# Altium schematic sheet Sheet1.SchDoc
size A3; SheetNumber: 1; SheetTotal: 1
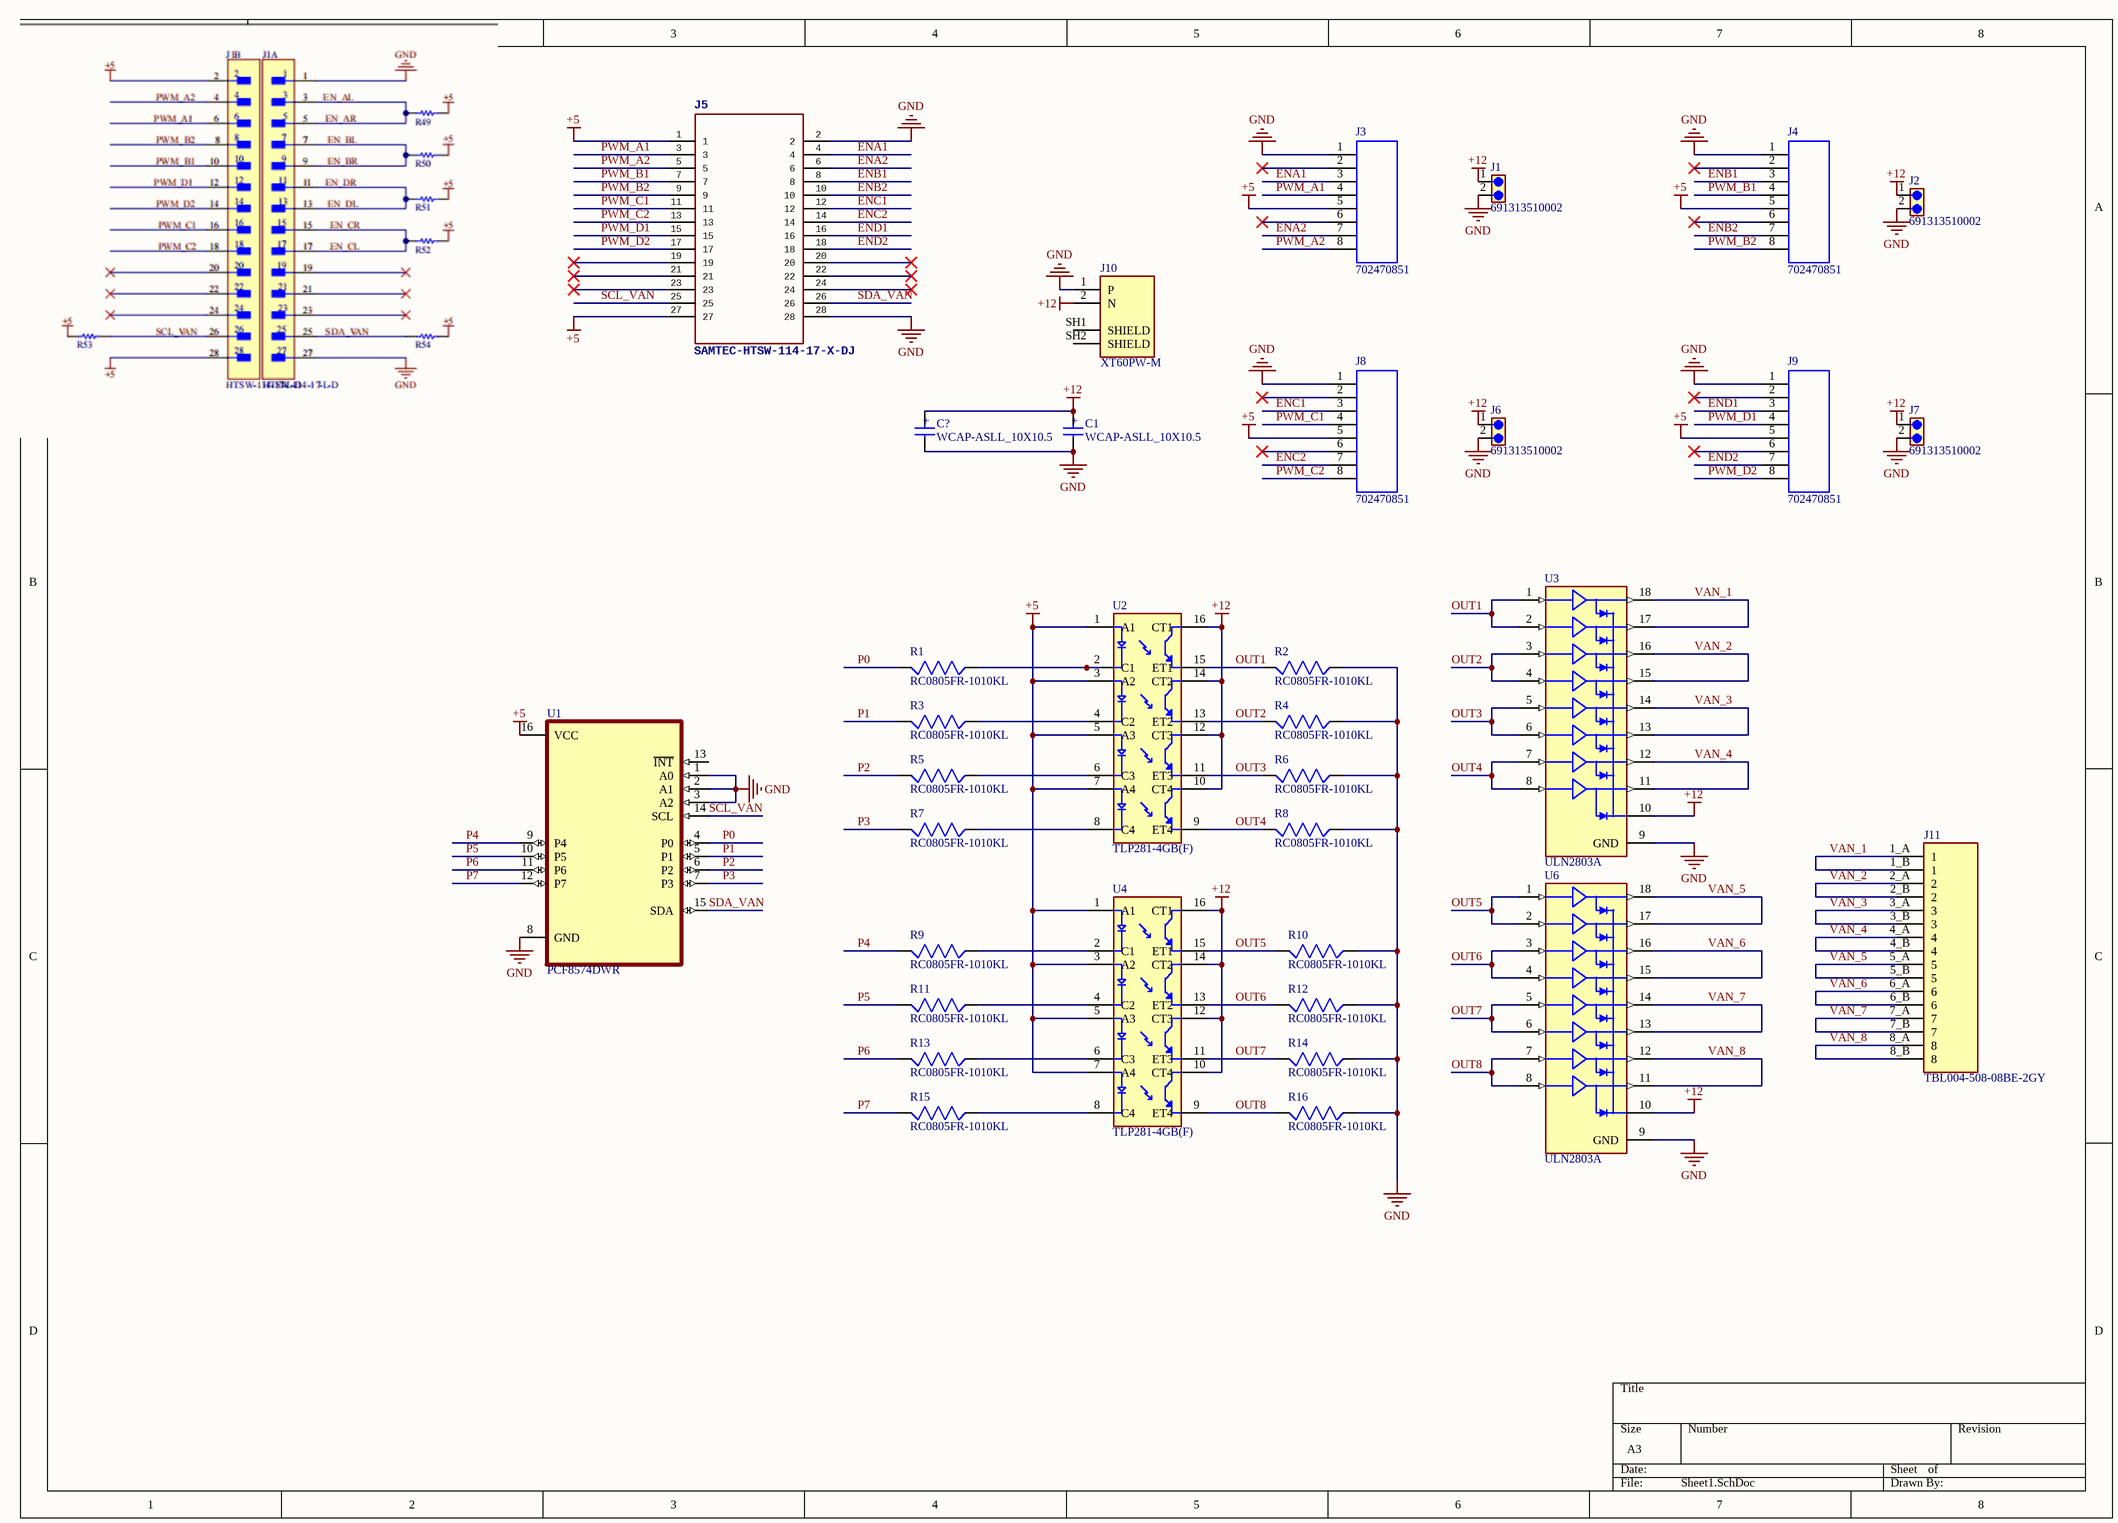
[diagram p0: Sheet1.SchDoc]

## Parts
C1  WCAP-ASLL_10X10.5  [WCAP-ASLL_10X10.5(DXL)]
C?  WCAP-ASLL_10X10.5  [WCAP-ASLL_10X10.5(DXL)]
J1  691313510002  [691313510002]
J2  691313510002  [691313510002]
J3  702470851  [CONN_7024708XX_MOL]
J4  702470851  [CONN_7024708XX_MOL]
J5  SAMTEC-HTSW-114-17-X-DJ  [SAMTEC-HTSW-114-17-X-D]
J6  691313510002  [691313510002]
J7  691313510002  [691313510002]
J8  702470851  [CONN_7024708XX_MOL]
J9  702470851  [CONN_7024708XX_MOL]
J10  XT60PW-M  [AMASS_XT60PW-M]
J11  TBL004-508-08BE-2GY  [CUI_TBL004-508-08BE-2GY]
R1  RC0805FR-1010KL  [RESC2012X60N]
R2  RC0805FR-1010KL  [RESC2012X60N]
R3  RC0805FR-1010KL  [RESC2012X60N]
R4  RC0805FR-1010KL  [RESC2012X60N]
R5  RC0805FR-1010KL  [RESC2012X60N]
R6  RC0805FR-1010KL  [RESC2012X60N]
R7  RC0805FR-1010KL  [RESC2012X60N]
R8  RC0805FR-1010KL  [RESC2012X60N]
R9  RC0805FR-1010KL  [RESC2012X60N]
R10  RC0805FR-1010KL  [RESC2012X60N]
R11  RC0805FR-1010KL  [RESC2012X60N]
R12  RC0805FR-1010KL  [RESC2012X60N]
R13  RC0805FR-1010KL  [RESC2012X60N]
R14  RC0805FR-1010KL  [RESC2012X60N]
R15  RC0805FR-1010KL  [RESC2012X60N]
R16  RC0805FR-1010KL  [RESC2012X60N]
U1  PCF8574DWR  [SOIC127P1030X265-16N]
U2  TLP281-4GB(F)  [SOIC127P700X210-16N]
U3  ULN2803A  [DIP850W46P254L2324H393Q18]
U4  TLP281-4GB(F)  [SOIC127P700X210-16N]
U6  ULN2803A  [DIP850W46P254L2324H393Q18]

## Nets
+5: J3.5 J4.5 J5.1 J5.27 J8.5 J9.5 U1.16(VCC) U2.1(A1) U2.3(A2) U2.5(A3) U2.7(A4) U4.1(A1) U4.3(A2) U4.5(A3) U4.7(A4)
+12: C1.1(POS) C?.1(POS) J1.1 J2.1 J6.1 J7.1 J10.2(N) U2.10(CT4) U2.12(CT3) U2.14(CT2) U2.16(CT1) U3.10(COMMON) U4.10(CT4) U4.12(CT3) U4.14(CT2) U4.16(CT1) U6.10(COMMON)
GND: C1.2(NEG) C?.2(NEG) J1.2 J2.2 J3.1 J4.1 J5.2 J5.28 J6.2 J7.2 J8.1 J9.1 J10.1(P) R2.2 R4.2 R6.2 R8.2 R10.2 R12.2 R14.2 R16.2 U1.1(A0) U1.2(A1) U1.3(A2) U1.8(GND) U3.9(GND) U6.9(GND)
ENA1: J3.3 J5.4
ENA2: J3.7 J5.6
ENB1: J4.3 J5.8
ENB2: J4.7 J5.10
ENC1: J5.12 J8.3
ENC2: J5.14 J8.7
END1: J5.16 J9.3
END2: J5.18 J9.7
OUT1: R2.1 U2.15(ET1) U3.1(IN_1) U3.2(IN_2)
OUT2: R4.1 U2.13(ET2) U3.3(IN_3) U3.4(IN_4)
OUT3: R6.1 U2.11(ET3) U3.5(IN_5) U3.6(IN_6)
OUT4: R8.1 U2.9(ET4) U3.7(IN_7) U3.8(IN_8)
OUT5: R10.1 U4.15(ET1) U6.1(IN_1) U6.2(IN_2)
OUT6: R12.1 U4.13(ET2) U6.3(IN_3) U6.4(IN_4)
OUT7: R14.1 U4.11(ET3) U6.5(IN_5) U6.6(IN_6)
OUT8: R16.1 U4.9(ET4) U6.7(IN_7) U6.8(IN_8)
P0: R1.1 U1.4(P0)
P1: R3.1 U1.5(P1)
P2: R5.1 U1.6(P2)
P3: R7.1 U1.7(P3)
P4: R9.1 U1.9(P4)
P5: R11.1 U1.10(P5)
P6: R13.1 U1.11(P6)
P7: R15.1 U1.12(P7)
PWM_A1: J3.4 J5.3
PWM_A2: J3.8 J5.5
PWM_B1: J4.4 J5.7
PWM_B2: J4.8 J5.9
PWM_C1: J5.11 J8.4
PWM_C2: J5.13 J8.8
PWM_D1: J5.15 J9.4
PWM_D2: J5.17 J9.8
SCL_VAN: J5.25 U1.14(SCL)
SDA_VAN: J5.26 U1.15(SDA)
VAN_1: J11.1_A(1) J11.1_B(1) U3.17(OUT_2) U3.18(OUT_1)
VAN_2: J11.2_A(2) J11.2_B(2) U3.15(OUT_4) U3.16(OUT_3)
VAN_3: J11.3_A(3) J11.3_B(3) U3.13(OUT_6) U3.14(OUT_5)
VAN_4: J11.4_A(4) J11.4_B(4) U3.11(OUT_8) U3.12(OUT_7)
VAN_5: J11.5_A(5) J11.5_B(5) U6.17(OUT_2) U6.18(OUT_1)
VAN_6: J11.6_A(6) J11.6_B(6) U6.15(OUT_4) U6.16(OUT_3)
VAN_7: J11.7_A(7) J11.7_B(7) U6.13(OUT_6) U6.14(OUT_5)
VAN_8: J11.8_A(8) J11.8_B(8) U6.11(OUT_8) U6.12(OUT_7)
NetR1_2: R1.2 U2.2(C1)
NetR3_2: R3.2 U2.4(C2)
NetR5_2: R5.2 U2.6(C3)
NetR7_2: R7.2 U2.8(C4)
NetR9_2: R9.2 U4.2(C1)
NetR11_2: R11.2 U4.4(C2)
NetR13_2: R13.2 U4.6(C3)
NetR15_2: R15.2 U4.8(C4)

Not connected (* = marked no-connect by the designer): J3 2* 6*; J4 2* 6*; J5 19* 20* 21* 22* 23* 24*; J8 2* 6*; J9 2* 6*; J10 SH1(SHIELD) SH2(SHIELD); U1 13(~{INT})

## Notes on the sheet
- (in symbol WCAP-ASLL_10X10.5) +

## Library data of the parts
C1 C? = WCAP-ASLL_10X10.5: MF: {'manufacturer': u'W\xfcrth Elektronik'}; MP: 865060457009; Package: None; Price: None; Value: *; Availability: Unavailable
J1 J2 J6 J7 = 691313510002: 313; 5.08mm Pitch Straight Pluggable Term Block, PCB Header, Through Hole, 2 Way ¦ Wurth Electronics 691313510002; MF: WÃ¼rth Elektronik; SnapEDA_Link: https://www.snapeda.com/parts/691313510002/W%25C3%25BCrth+Elektronik+Midcom/view-part/?ref=snap; Package: None; Value: *; MP: 691313510002; Check_prices: https://www.snapeda.com/parts/691313510002/W%25C3%25BCrth+Elektronik+Midcom/view-part/?ref=eda
J3 J4 J8 J9 = 702470851: Conn Shrouded Header (4 Sides) HDR 8 POS 2.54mm Solder RA Thru-Hole C-GridÂ® Tray; MF: Molex; SnapEDA_Link: https://www.snapeda.com/parts/702470851/Molex/view-part/?ref=snap; Package: None; Value: *; MP: 702470851; Check_prices: https://www.snapeda.com/parts/702470851/Molex/view-part/?ref=eda
J10 = XT60PW-M: Socket, DC supply, male, PIN: 2; MF: AMASS; SnapEDA_Link: https://www.snapeda.com/parts/XT60PW-M/AMASS/view-part/?ref=snap; Package: Package; Value: *; MP: XT60PW-M; Check_prices: https://www.snapeda.com/parts/XT60PW-M/AMASS/view-part/?ref=eda
J11 = TBL004-508-08BE-2GY: 2~24 Poles, Screwless, Horizontal, 5.08 Pitch, 24~14 (AWG), Terminal Block Connector; MF: Same Sky; SnapEDA_Link: https://www.snapeda.com/parts/TBL004-508-08BE-2GY/Same+Sky/view-part/?ref=snap; Package: None; Value: *; MP: TBL004-508-08BE-2GY; Check_prices: https://www.snapeda.com/parts/TBL004-508-08BE-2GY/Same+Sky/view-part/?ref=eda
R1-R16 = RC0805FR-1010KL: RES, THICK FILM, 10K, 1%, 0.125W, 0805;; RES, THICK FILM, 10K, 1%, 0.125W, 0805; Resistance:10kohm; Resistance Tolerance:Â± 1%; Power Rating:125mW; Resistor Case Style:0805 ^2012 Metric]; Resistor Technology:Thick Film; Resistor Type:General Purpose; Prod; MF: Yageo Corporation; MP: RC0805FR1010KL; SnapEDA_Link: https://www.snapeda.com/parts/RC0805FR1010KL/Yageo/view-part/?ref=snap; Package: 0805-2 YAGEO; Value: *; Check_prices: https://www.snapeda.com/parts/RC0805FR1010KL/Yageo/view-part/?ref=eda
U1 = PCF8574DWR: 8-bit 2.5- to 5.5-V I2C/SMBus I/O expander with interrupt; MF: Texas Instruments; SnapEDA_Link: https://www.snapeda.com/parts/PCF8574DWR/Texas+Instruments/view-part/?ref=snap; Package: SOIC-16 Texas Instruments; Value: *; MP: PCF8574DWR; Check_prices: https://www.snapeda.com/parts/PCF8574DWR/Texas+Instruments/view-part/?ref=eda
U2 U4 = TLP281-4GB(F): Optocoupler DC-IN 4-CH Transistor DC-OUT 16-Pin SOP; MF: Toshiba; SnapEDA_Link: https://www.snapeda.com/parts/TLP281-4GB(F)/Toshiba/view-part/?ref=snap; Package: SOP-16 Toshiba; Value: *; MP: TLP281-4GB(F); Check_prices: https://www.snapeda.com/parts/TLP281-4GB(F)/Toshiba/view-part/?ref=eda
U3 U6 = ULN2803A: Package: None; Price: None; Value: *; MP: ULN2803A; Availability: Unavailable